# Altium project PDB_REV 23.PrjPcb
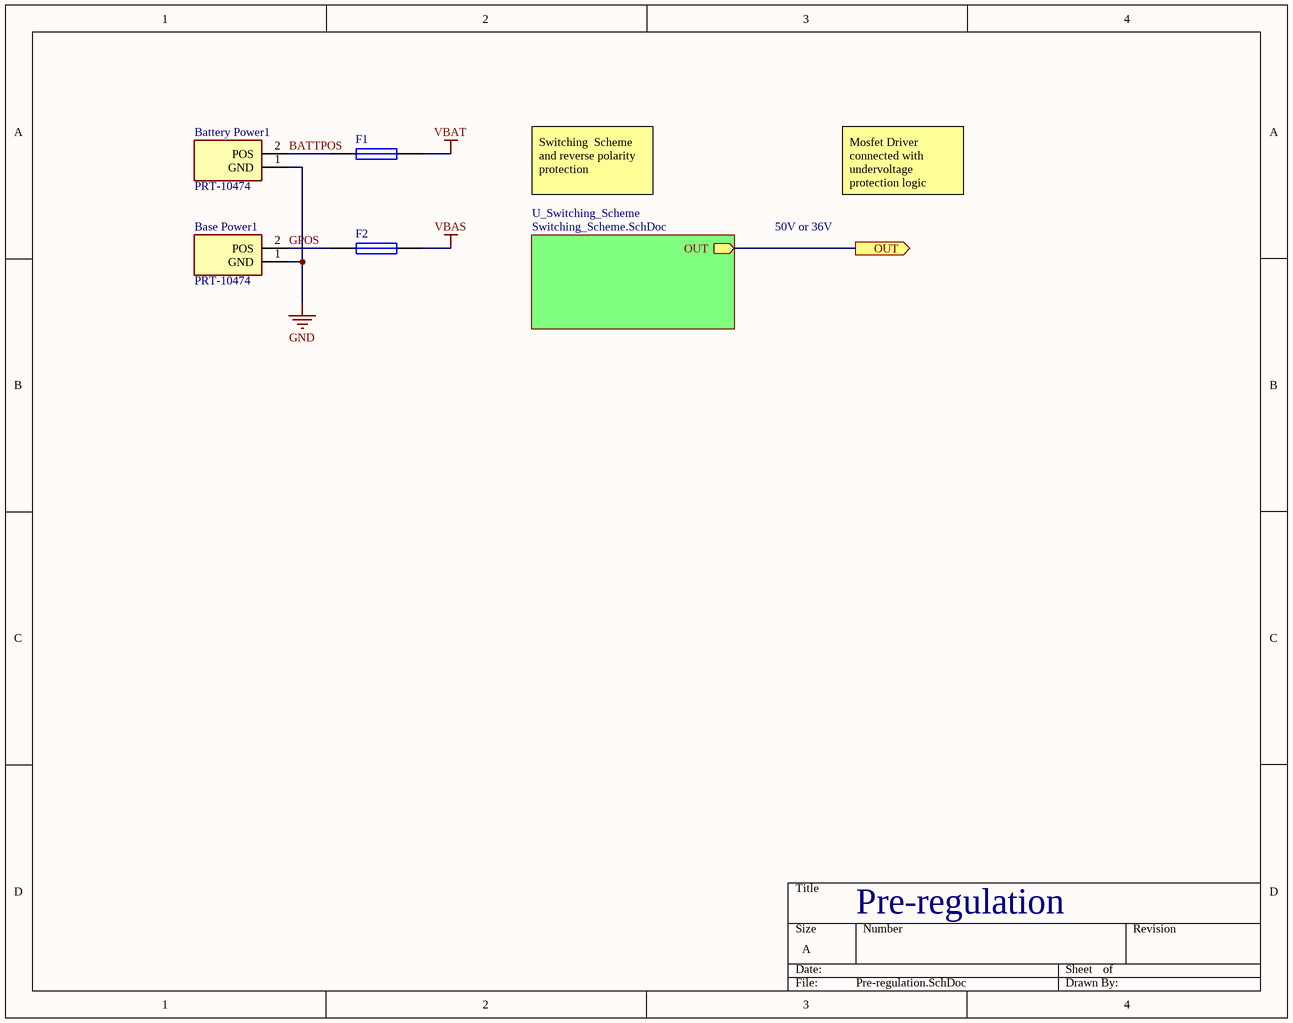
[diagram p0: Pre-regulation.SchDoc]
5 sheets, 44 parts. Net scope: hierarchical (ports join the sheet entries above them; power ports are global).
Board file: PDB REV 23.PcbDoc
Sheets:
  Pre-regulation.SchDoc
    U_Switching_Scheme = Switching_Scheme.SchDoc
  BusDistribution.SchDoc
  Regulation.SchDoc
  Sheet1.SchDoc

## Sheet Pre-regulation.SchDoc
size A

### Parts
Base_Power1  PRT-10474  [PRT-10474]
Battery_Power1  PRT-10474  [PRT-10474]
F1  Battery Power Fuse  [14-1210]  (value not drawn)
F2  Ground Power Fuse  [14-1210]  (value not drawn)

### Sub-sheets
U_Switching_Scheme = Switching_Scheme.SchDoc: OUT (out)

### Ports
OUT (out)

### Nets
GND: Base_Power1.1(GND) Battery_Power1.1(GND)
VBAS: F2.2
VBAT: F1.2
BATTPOS: Battery_Power1.2(POS) F1.1
GPOS: Base_Power1.2(POS) F2.1
NetC3_1: port OUT, sheet U_Switching_Scheme/OUT

### Notes on the sheet
- Switching  Scheme and reverse polarity protection
- 50V or 36V
- Mosfet Driver connected with undervoltage protection logic
- Pre-regulation

### Library data of the parts
Base_Power1 Battery_Power1 = PRT-10474: Connector; Manufacturer_Name: SparkFun; Datasheet Link: http://cdn.sparkfun.com/datasheets/Prototyping/xt60.pdf; Height: 15.875mm; Manufacturer_Part_Number: PRT-10474; Mouser Part Number: 474-PRT-10474; Mouser Price/Stock: https://www.mouser.com/Search/Refine.aspx?Keyword=474-PRT-10474
F1 F2 = Fuse 1: Fuse; Published: 8-Jun-2000; LatestRevisionDate: 17-Jul-2002; LatestRevisionNote: Re-released for DXP Platform.; PackageReference: PIN-W2/E2.8; Publisher: Altium Limited; PackageDescription: Thru-Hole; 2 Leads

## Sheet Switching_Scheme.SchDoc
size A
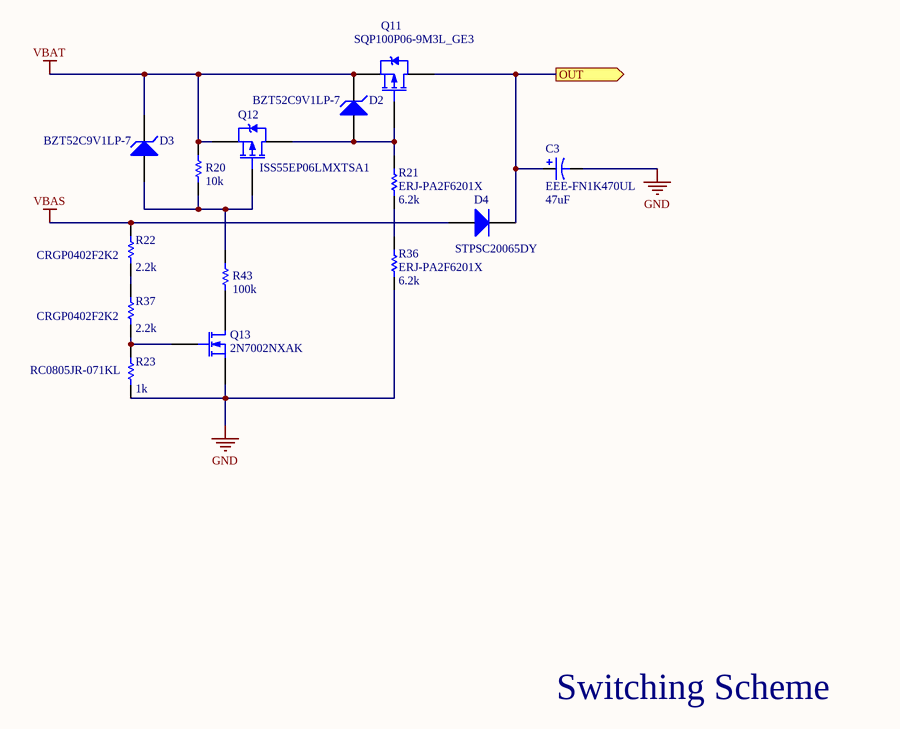
[diagram p1: Switching_Scheme.SchDoc]

### Parts
C3  EEE-FN1K470UL  value 47uF  [CAPAE1030X1450N]
D2  BZT52C9V1LP-7  [0402]
D3  BZT52C9V1LP-7  [0402]
D4  STPSC20065DY  [TO-220AC]
Q11  SQP100P06-9M3L_GE3  [TO-220AB]
Q12  ISS55EP06LMXTSA1  [SOT23_L]
Q13  2N7002NXAK  [SOT23_L]
R20  value 10k  [0402]  (hidden comment: RC0402FR-0710KL)
R21  ERJ-PA2F6201X  value 6.2k  [0402]
R22  CRGP0402F2K2  value 2.2k  [0402]
R23  RC0805JR-071KL  value 1k  [0402]
R36  ERJ-PA2F6201X  value 6.2k  [0402]
R37  CRGP0402F2K2  value 2.2k  [0402]
R43  value 100k  [0402]  (hidden comment: RC0402FR-0710KL)

### Ports
OUT (out)

### Nets
GND: C3.2 Q13.3(S) R23.1 R36.2
VBAS: D4.1(A) R22.2
VBAT: D2.2(K) D3.2(K) Q11.3(S) Q12.3(S) R20.2
NetC3_1: C3.1 D4.2(K) Q11.2(D) ; port OUT
NetD2_1: D2.1(A) Q11.1(G) Q12.2(D) R21.1
NetD3_1: D3.1(A) Q12.1(G) R20.1 R43.2
NetQ13_1: Q13.1(D) R43.1
NetQ13_2: Q13.2(G) R23.2 R37.1
NetR21_2: R21.2 R36.1
NetR22_1: R22.1 R37.2

### Notes on the sheet
- Switching Scheme

### Library data of the parts
C3 = Cap Pol1: 80VDC 47uF 20% 8x10.2mm AEC-Q200; MFG PN: EEH-ZF1J330P; MFG: Panasonic
D2 D3 = D Zener: Zener Diode 9.1V 250mW ±6% Surface Mount X1-DFN1006-2; MFG: Diodes Incorporated; Package: 0402; MFG PN: BZT52C9V1LP-7
D4 = Diode: Diode Silicon Carbide Schottky 650V 20A Through Hole TO-220AC; pin to pad: 2>3; MFG: STMicroelectronics; MFG PN: STPSC20065DY
Q11 = PMOS-2: P-Channel 60V 100A (Tc) 187W (Tc) Through Hole TO-220AB; Published: 8-Jun-2000; LatestRevisionDate: 17-Jul-2002; LatestRevisionNote: Re-released for DXP Platform.; DatasheetVersion: PD-9.390D; PackageVersion: Feb-1997; PackageReference: TO-220AB; Publisher: Vishay Siliconix; PackageDescription: TO, Thru-Hole, Vertical, Heatsink Mounted; 3 In-Line Leads; Pitch 2.54 mm; ComponentLink1Description: Manufacturer Link; ComponentLink1URL: http://www.irf.com/
Q12 = PMOS-2: P-Channel 60V 180mA (Ta) 400mW (Ta) Surface Mount PG-SOT23-3-5; MFG: Infineon Technologies; PackageReference: TO-220AB; Publisher: ISS55EP06LMXTSA1; ComponentLink1Description: Manufacturer Link; ComponentLink1URL: http://www.irf.com/; MFG PN: ISS55EP06LMXTSA1
Q13 = MOSFET-N: N-Channel 60V 190mA (Ta), 300mA (Tc) 265mW (Ta), 1.33W (Tc) Surface Mount TO-236AB; MFG: Nexperia USA; MDF PN: 2N7002NXAK
R20 R43 = Res1: 10 kOhms ±1% 0.063W, 1/16W Chip Resistor 0402 (1005 Metric) Thick Film; Manufacturer: Yageo; MFG PN: RC0402FR-0710KL
R21 R36 = Res1: ±1% 0.2W, 1/5W Chip Resistor 0402 (1005 Metric) Automotive AEC-Q200, Pulse Withstanding Thick Film; Manufacturer: Panasonic Electronic Components; PackageDescription: ±1% 0.2W, 1/5W Chip Resistor 0402 (1005 Metric) Automotive AEC-Q200, Pulse Withstanding Thick Film; MFG PN: ERJ-PA2F6201X
R22 R37 = Res1: 2.2 kOhms ±1% 0.125W, 1/8W Chip Resistor 0402 (1005 Metric) Pulse Withstanding Thick Film; MFG: TE Connectivity Passive Product; MFG PN: CRGP0402F2K2
R23 = Res1: 1 kOhms ±5% 0.125W, 1/8W Chip Resistor 0805 (2012 Metric)  Thick Film; MFG: Yageo; MFG PN: RC0805JR-071KL

## Sheet BusDistribution.SchDoc
size A
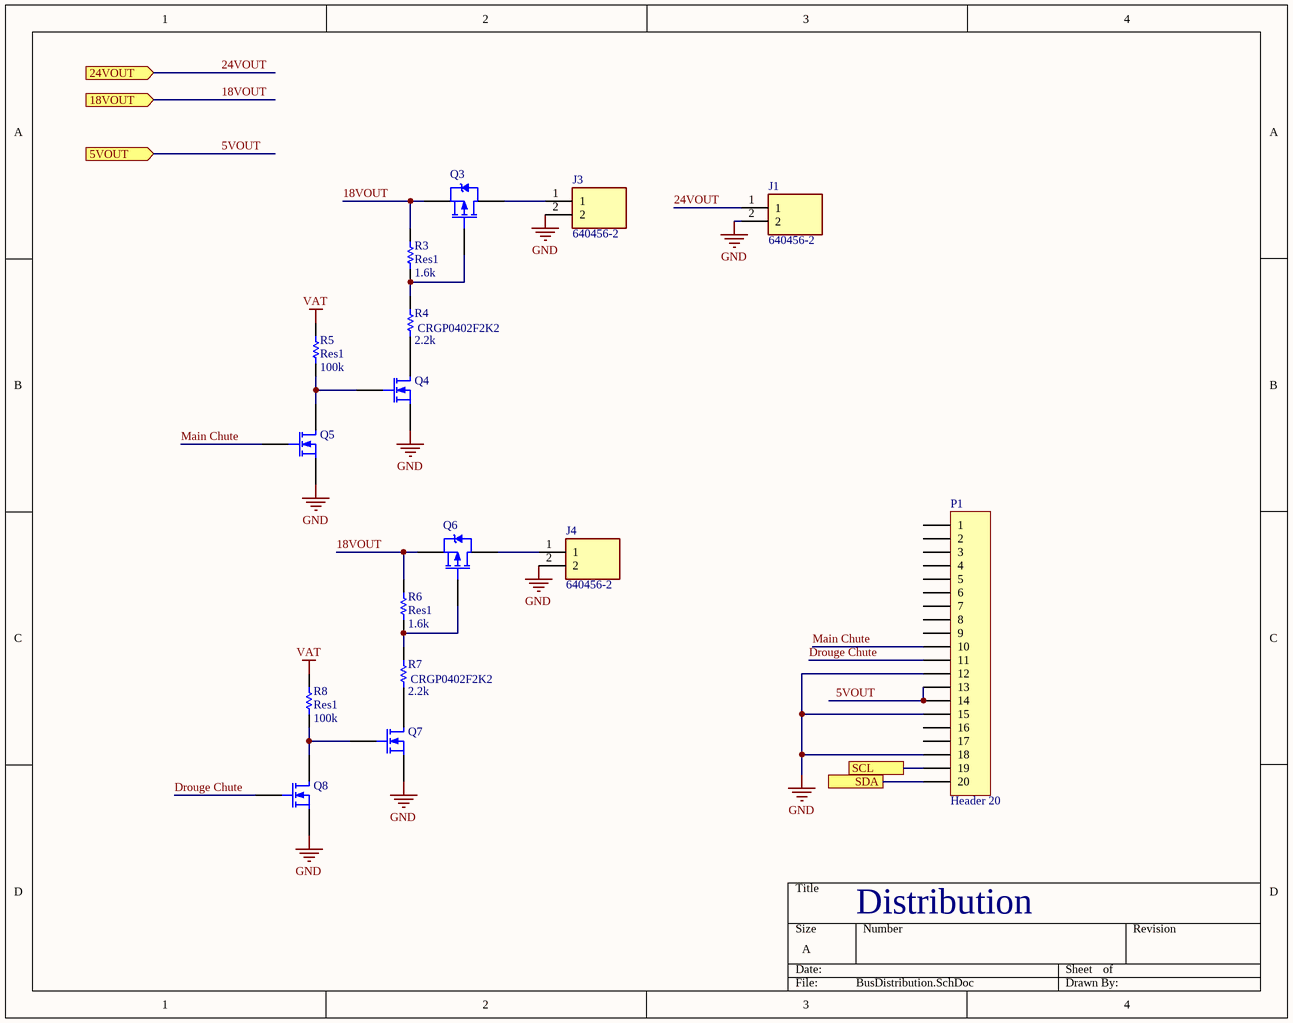
[diagram p2: BusDistribution.SchDoc]

### Parts
J1  640456-2  [16404562]
J3  640456-2  [16404562]
J4  640456-2  [16404562]
P1  Header 20  [HDR1X20]
Q3  MED power PMOS  [SOT23_L]  (value not drawn)
Q4  Low Power NMOS  [SOT23_L]  (value not drawn)
Q5  Low power NMOS  [SOT23_L]  (value not drawn)
Q6  MED power PMOS  [SOT23_L]  (value not drawn)
Q7  Low Power NMOS  [SOT23_L]  (value not drawn)
Q8  Low Power NMOS  [SOT23_L]  (value not drawn)
R3  Res1  value 1.6k  [0402]
R4  CRGP0402F2K2  value 2.2k  [0402]
R5  Res1  value 100k  [0402]
R6  Res1  value 1.6k  [0402]
R7  CRGP0402F2K2  value 2.2k  [0402]
R8  Res1  value 100k  [0402]

### Ports
5VOUT (in), 18VOUT (in), 24VOUT (in), SCL, SDA

### Nets
GND: J1.2 J3.2 J4.2 P1.12 P1.15 P1.18 Q4.3(S) Q5.3(S) Q7.3(S) Q8.3(S)
VAT: R5.2 R8.2
5VOUT: P1.13 P1.14 ; port 5VOUT
18VOUT: Q3.3(S) Q6.3(S) R3.2 R6.2 ; port 18VOUT
24VOUT: J1.1 ; port 24VOUT
Drouge Chute: P1.11 Q8.2(G)
Main Chute: P1.10 Q5.2(G)
NetJ3_1: J3.1 Q3.2(D)
NetJ4_1: J4.1 Q6.2(D)
NetP1_19: P1.19 ; port SCL
NetP1_20: P1.20 ; port SDA
NetQ3_1: Q3.1(G) R3.1 R4.2
NetQ4_1: Q4.1(D) R4.1
NetQ4_2: Q4.2(G) Q5.1(D) R5.1
NetQ6_1: Q6.1(G) R6.1 R7.2
NetQ7_1: Q7.1(D) R7.1
NetQ7_2: Q7.2(G) Q8.1(D) R8.1

Not connected (* = marked no-connect by the designer): P1 1 2 3 4 5 6 7 8 9 16 17

### Notes on the sheet
- Distribution

### Library data of the parts
J1 J3 J4 = 640456-2: Connector; Manufacturer_Name: TE Connectivity; Allied_Number: 70083642; Datasheet Link: http://www.te.com/commerce/DocumentDelivery/DDEController?Action=showdoc&DocId=Customer+Drawing%7F640456%7FW3%7Fpdf%7FEnglish%7FENG_CD_640456_W3.pdf%7F640456-2; Height: 7.747mm; Manufacturer_Part_Number: 640456-2; Mouser Part Number: 571-6404562; Mouser Price/Stock: https://www.mouser.com/Search/Refine.aspx?Keyword=571-6404562; RS Part Number: 1320355P; RS Price/Stock: http://uk.rs-online.com/web/p/products/1320355P; Allied Price/Stock: https://www.alliedelec.com/te-connectivity-640456-2/70083642/
P1 = Header 20: Header, 20-Pin; LatestRevisionDate: 17-Jul-2002; LatestRevisionNote: Re-released for DXP Platform.; Publisher: Altium Limited
Q3 Q6 = PMOS-2: P-Channel Power MOSFET; Note: Pin 4 not drawn and electrically connected to Pin 2.; Published: 8-Jun-2000; LatestRevisionDate: 17-Jul-2002; LatestRevisionNote: Re-released for DXP Platform.; DatasheetVersion: PD-9.390D; PackageVersion: Feb-1997; PackageReference: TO-220AB; Publisher: Altium Limited; PackageDescription: TO, Thru-Hole, Vertical, Heatsink Mounted; 3 In-Line Leads; Pitch 2.54 mm; ComponentLink1Description: Manufacturer Link; ComponentLink1URL: http://www.irf.com/
Q4 Q5 Q7 Q8 = MOSFET-N: N-Channel MOSFET; Published: 8-Jun-2000; LatestRevisionDate: 17-Jul-2002; LatestRevisionNote: Re-released for DXP Platform.; PackageVersion: 1995/1996; PackageReference: E3; Publisher: Altium Limited; PackageDescription: TO, Flat Index; 3 In-Line, Axial Leads; Body Dia. 4.6mm; Lead Dia. 0.5 mm (max)
R3 R5 R6 R8 = Res1: Resistor; Published: 8-Jun-2000; LatestRevisionDate: 17-Jul-2002; LatestRevisionNote: Re-released for DXP Platform.; PackageReference: AXIAL-0.3; Publisher: Altium Limited; PackageDescription: Axial Device, Thru-Hole; 2 Leads; 0.3 in Pin Spacing
R4 R7 = Res1: as R22 on sheet Switching_Scheme; MFG PN: CRGP0402F2K2

## Sheet Regulation.SchDoc
size A
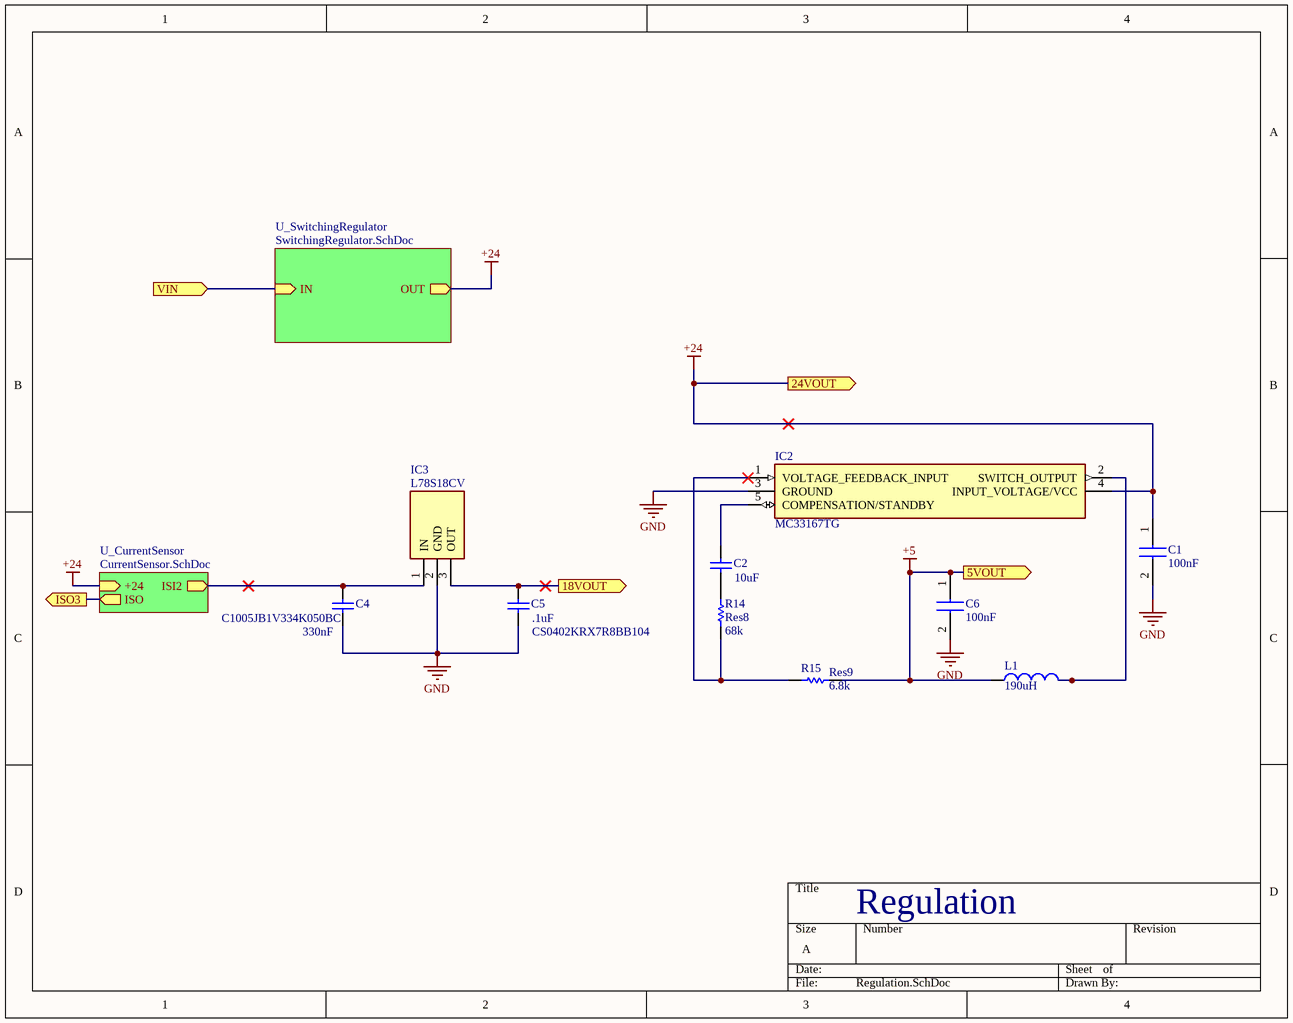
[diagram p3: Regulation.SchDoc]

### Parts
C1  100nF  [865230640001]
C2  value 10uF  [C0805]  (hidden comment: 10uF Cap)
C4  C1005JB1V334K050BC  value 330nF  [0402]
C5  CS0402KRX7R8BB104  value .1uF  [Model Name]
C6  100nF  [865230640001]
IC2  MC33167TG  [MC33167TG]
IC3  L78S18CV  [TO270P460X1020X2008-3P]
L1  value 190uH  [PA2982]  (hidden comment: 190uH Inductor)
R14  Res8  value 68k  [0402]
R15  Res9  value 6.8k  [0402]

### Sub-sheets
U_CurrentSensor = CurrentSensor.SchDoc (file not in this document): +24 (in), ISI2 (out), ISO (out)
U_SwitchingRegulator = SwitchingRegulator.SchDoc (file not in this document): IN (in), OUT (out)

### Ports
5VOUT (out), 18VOUT (out), 24VOUT (out), ISO3 (out), VIN (in)

### Nets
+5: C6.1(-) L1.1 R15.2 ; port 5VOUT
+24: C1.1(-) IC2.4(INPUT_VOLTAGE/VCC) ; port 24VOUT, sheet U_CurrentSensor/+24, sheet U_SwitchingRegulator/OUT
GND: C1.2(+) C4.1 C5.1 C6.2(+) IC2.3(GROUND) IC3.2(GND)
NetC2_1: C2.1 R14.2
NetC2_2: C2.2 IC2.5(COMPENSATION/STANDBY)
NetC4_2: C4.2 IC3.1(IN) ; sheet U_CurrentSensor/ISI2
NetC5_2: C5.2 IC3.3(OUT) ; port 18VOUT
NetIC2_1: IC2.1(VOLTAGE_FEEDBACK_INPUT) R14.1 R15.1
NetIC2_2: IC2.2(SWITCH_OUTPUT) L1.2
(unnamed): port ISO3, sheet U_CurrentSensor/ISO
(unnamed): port VIN, sheet U_SwitchingRegulator/IN

### Notes on the sheet
- Regulation

### Library data of the parts
C1 C6 = 865230640001: Capacitor; Manufacturer_Name: Wurth Elektronik; Datasheet Link: http://uk.rs-online.com/webdocs/135a/0900766b8135a640.pdf; Manufacturer_Part_Number: 865230640001; Arrow Part Number: 865230640001; Mouser Part Number: 710-865230640001; Mouser Price/Stock: https://www.mouser.co.uk/ProductDetail/Wurth-Elektronik/865230640001?qs=0KOYDY2FL28kfhWstjZGVg%3D%3D
C2 = Cap: Capacitor; Published: 8-Jun-2000; LatestRevisionDate: 17-Jul-2002; LatestRevisionNote: Re-released for DXP Platform.; PackageReference: RAD-0.3; Publisher: Altium Limited; PackageDescription: Radial Cap, Thru-Hole; 2 Leads; 0.3 in Pin Spacing
C4 = Cap: CAP CER 0.33UF 35V JB 0402; Manufacturer 1: TDK Corporation; Published: 8-Jun-2000; LatestRevisionDate: 17-Jul-2002; LatestRevisionNote: Re-released for DXP Platform.; PackageReference: RAD-0.3; Publisher: Altium Limited; PackageDescription: Radial Cap, Thru-Hole; 2 Leads; 0.3 in Pin Spacing; Manufacturer Part Number 1: C1005JB1V334K050BC
C5 = Cap: CAP CER 0.1UF 25V X7R 0402; Manufacturer 1: Yageo; LatestRevisionNote: Re-released for DXP Platform.; PackageReference: RAD-0.3; Publisher: Altium Limited; PackageDescription: Radial Cap, Thru-Hole; 2 Leads; 0.3 in Pin Spacing; Manufacturer Part Number 1: CS0402KRX7R8BB104
IC2 = MC33167TG: Integrated Circuit; Manufacturer_Name: ON Semiconductor; Allied_Number: 70340012; Datasheet Link: http://www.onsemi.com/pub/Collateral/MC34167-D.PDF; Manufacturer_Part_Number: MC33167TG; Mouser Part Number: 863-MC33167TG; Mouser Price/Stock: https://www.mouser.com/Search/Refine.aspx?Keyword=863-MC33167TG; RS Part Number: 7862414P; RS Price/Stock: http://uk.rs-online.com/web/p/products/7862414P; Allied Price/Stock: http://www.alliedelec.com/on-semiconductor-mc33167tg/70340012/
IC3 = L78S18CV: Integrated Circuit; Manufacturer_Name: STMicroelectronics; Allied_Number: 70013917; Datasheet Link: http://www.st.com/web/en/resource/technical/document/datasheet/CD00000449.pdf; Height: 4.6mm; Manufacturer_Part_Number: L78S18CV; Mouser Part Number: 511-L78S18CV; Mouser Price/Stock: https://www.mouser.com/Search/Refine.aspx?Keyword=511-L78S18CV; RS Part Number: 6869022P; RS Price/Stock: http://uk.rs-online.com/web/p/products/6869022P; Allied Price/Stock: http://www.alliedelec.com/stmicroelectronics-l78s18cv/70013917/
L1 = Inductor: Code_IEC: 1005; Published: 8-Jun-2000; LatestRevisionDate: 29-May-2009; LatestRevisionNote: IPC-7351 Footprint Added.; PackageReference: 0402-A; Publisher: Altium Limited; PackageDescription: Chip Inductor; Code_JEITA: 0402
R14 R15 = Res1: Resistor; Published: 8-Jun-2000; LatestRevisionDate: 17-Jul-2002; LatestRevisionNote: Re-released for DXP Platform.; PackageReference: AXIAL-0.3; Publisher: Altium Limited; PackageDescription: Axial Device, Thru-Hole; 2 Leads; 0.3 in Pin Spacing

## Sheet Sheet1.SchDoc
size A

## Nets that join several sheets
GND: Pre-regulation (Base_Power1.1 Battery_Power1.1), Switching_Scheme (C3.2 Q13.3 R23.1 R36.2), BusDistribution (10 pins), Regulation (6 pins)
VBAS: Pre-regulation (F2.2), Switching_Scheme (D4.1 R22.2)
VBAT: Pre-regulation (F1.2), Switching_Scheme (5 pins)